# EAGLE design magic-donut (EAGLE 9.4.2)
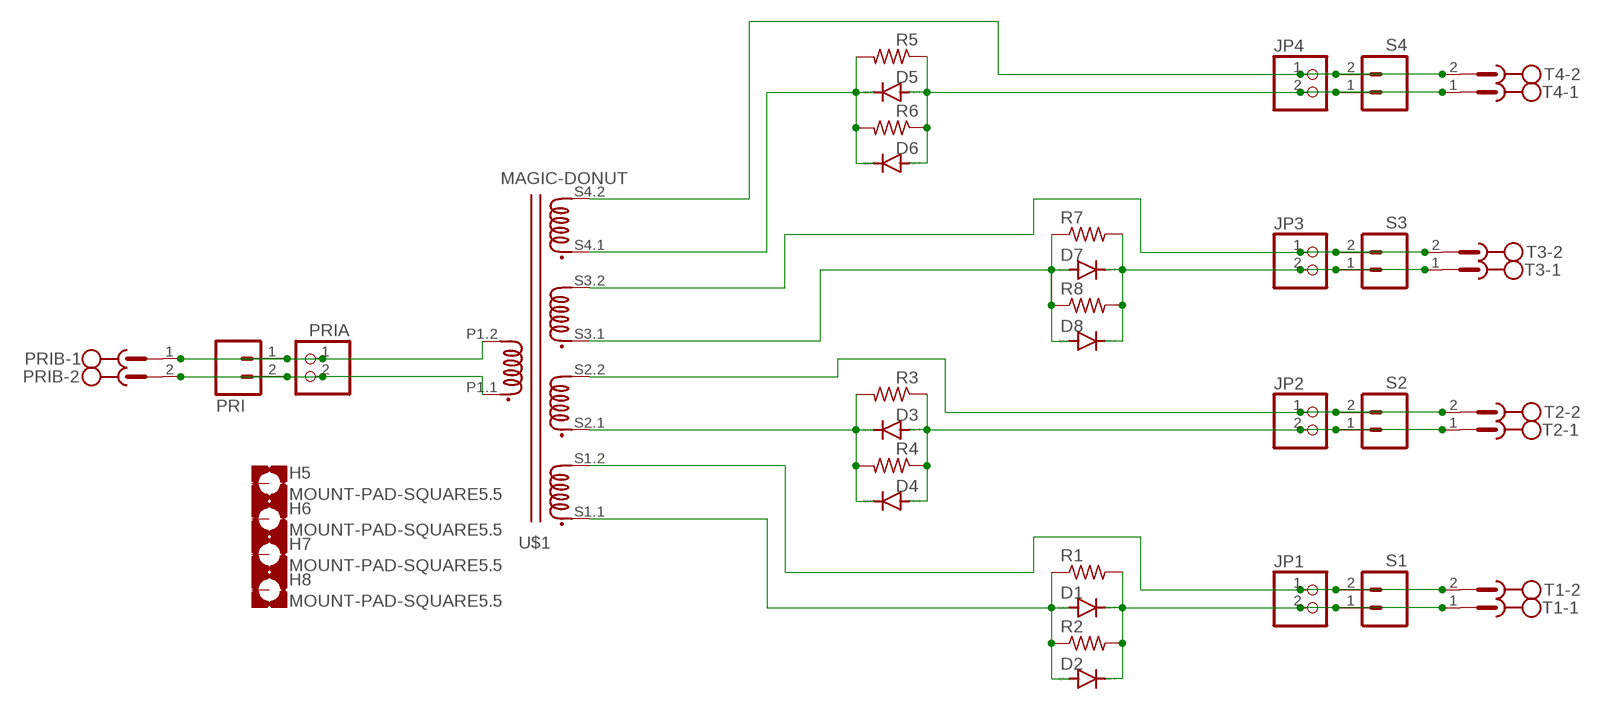
[diagram p0: schematic, sheet 1]

## Parts
D1  DIODE-DO214AA  [DO214AA]
D2  DIODE-DO201-15  [DO201-15]
D3  DIODE-DO214AA  [DO214AA]
D4  DIODE-DO201-15  [DO201-15]
D5  DIODE-DO214AA  [DO214AA]
D6  DIODE-DO201-15  [DO201-15]
D7  DIODE-DO214AA  [DO214AA]
D8  DIODE-DO201-15  [DO201-15]
H5  MOUNT-PAD-SQUARE5.5  [5,5-PAD-SQUARE]
H6  MOUNT-PAD-SQUARE5.5  [5,5-PAD-SQUARE]
H7  MOUNT-PAD-SQUARE5.5  [5,5-PAD-SQUARE]
H8  MOUNT-PAD-SQUARE5.5  [5,5-PAD-SQUARE]
JP1  PINHD-1X2  [1X02]
JP2  PINHD-1X2  [1X02]
JP3  PINHD-1X2  [1X02]
JP4  PINHD-1X2  [1X02]
PRI  M02JST-PTH-2  [JST-2-PTH]
PRIA  PINHD-1X2  [1X02]
PRIB  MSTBV2  [MSTBV2]
R1  R-US_R0805  [R0805]
R2  R-US_0207/7  [0207/7]
R3  R-US_R0805  [R0805]
R4  R-US_0207/7  [0207/7]
R5  R-US_R0805  [R0805]
R6  R-US_0207/7  [0207/7]
R7  R-US_R0805  [R0805]
R8  R-US_0207/7  [0207/7]
S1  M02JST-PTH-2  [JST-2-PTH]
S2  M02JST-PTH-2  [JST-2-PTH]
S3  M02JST-PTH-2  [JST-2-PTH]
S4  M02JST-PTH-2  [JST-2-PTH]
T1  MSTBV2  [MSTBV2]
T2  MSTBV2  [MSTBV2]
T3  MSTBV2  [MSTBV2]
T4  MSTBV2  [MSTBV2]
U$1  MAGIC-DONUT  [TOROID]

## Nets
N$4: D5.C D6.C R5.2 R6.2 U$1.S4.1
N$5: JP3.1 S3.2 T3.2 U$1.S3.2
N$6: D7.A D8.A R7.1 R8.1 U$1.S3.1
N$8: D3.A D4.A JP2.2 R3.1 R4.1 S2.1 T2.1
N$9: JP4.1 S4.2 T4.2 U$1.S4.2
N$11: PRI.1 PRIA.1 PRIB.1 U$1.P1.2
N$12: PRI.2 PRIA.2 PRIB.2 U$1.P1.1
N$17: D5.A D6.A JP4.2 R5.1 R6.1 S4.1 T4.1
N$20: D7.C D8.C JP3.2 R7.2 R8.2 S3.1 T3.1
N$21: JP2.1 S2.2 T2.2 U$1.S2.2
N$22: D3.C D4.C R3.2 R4.2 U$1.S2.1
N$23: JP1.1 S1.2 T1.2 U$1.S1.2
N$26: D1.C D2.C JP1.2 R1.2 R2.2 S1.1 T1.1
S1-1: D1.A D2.A R1.1 R2.1 U$1.S1.1
Unconnected: H5.B5,5(MOUNT) H6.B5,5(MOUNT) H7.B5,5(MOUNT) H8.B5,5(MOUNT)

## Library data of the parts
D1-D8 = diode:DIODE-: DIODE
H5-H8 = holes:MOUNT-PAD-SQUARE: MOUNTING PAD, square
JP1-JP4 PRIA = pinhead:PINHD-1X2: PIN HEADER
PRI S1-S4 = SparkFun-Connectors:M02: Standard 2-pin 0.1" header. Use with - straight break away headers ( PRT-00116) - right angle break away headers (PRT-00553) - swiss pins (PRT-00743) - machine pins (PRT-00117) - female headers (PRT-00115) Molex polarized connector foot print use with: PRT-08233 with associated crimp pins and housings. 2.54_SCREWTERM for use with PRT-10571. 3.5mm Screw Terminal footprints for PRT-08084 5mm Screw Terminal footprints for use with PRT-08432; PROD_ID: CONN-09863; SKU: PRT-09914
PRIB T1-T4 = con-phoenix-500:MSTBV2: PHOENIX; OC_FARNELL: unknown; OC_NEWARK: unknown
R1-R8 = rcl:R-US_: RESISTOR, American symbol; SPICEPREFIX: R
U$1 = magic-donut:MAGIC-DONUT

## Net classes
0 default: width 1.016 mm

## Board
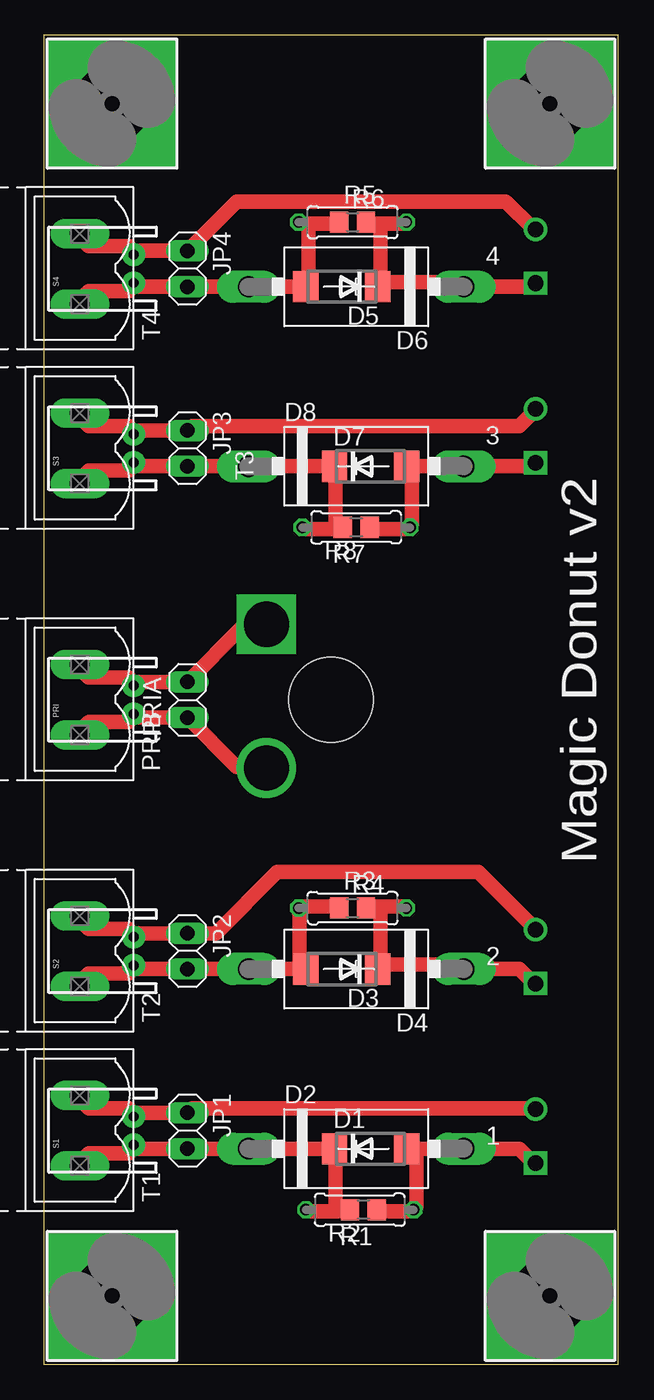
[diagram p1: board, top side]
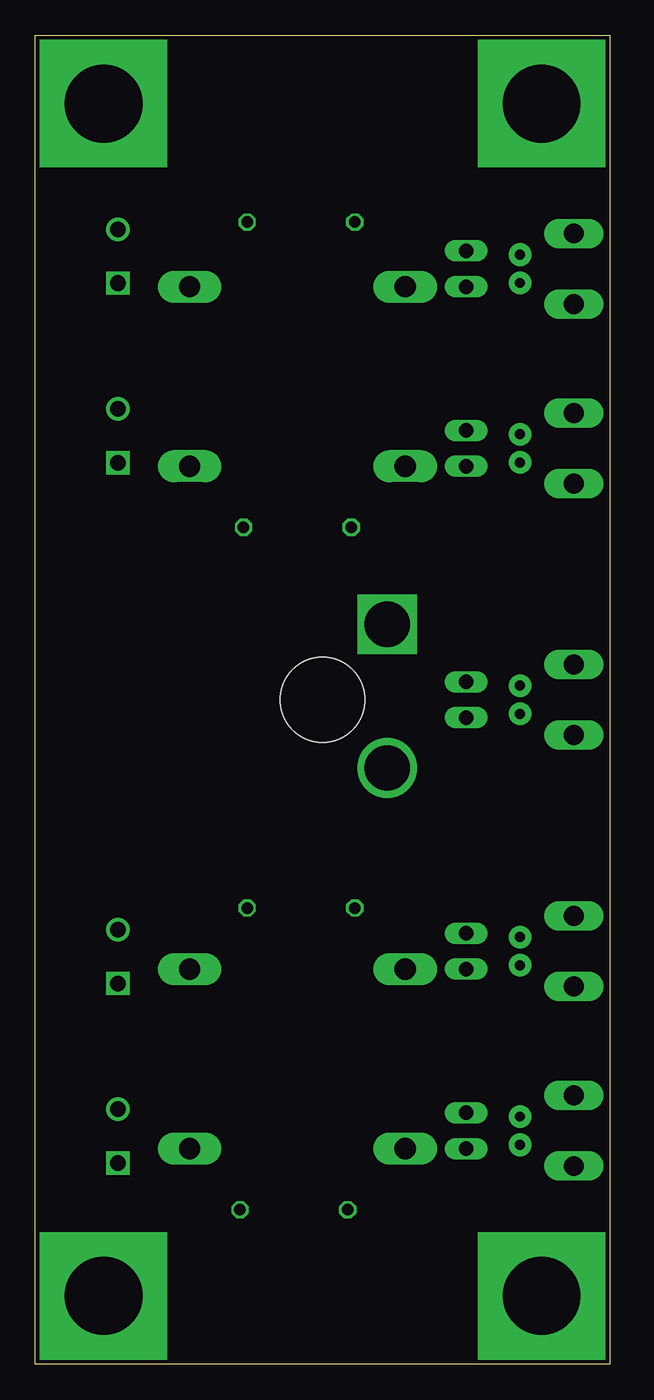
[diagram p2: board, bottom side, seen from below]

Size 40.64 x 93.98 mm. Coordinates in mm from the lower left corner, seen from the top.
Outline: 0,0 40.64,0 40.64,93.98 0,93.98 0,0
Copper layers (1*16): Top 0.0356mm / dielectric 1.5011mm / Bottom 0.0356mm
Design rules "oshpark": minimum track width 6mil, minimum drill 13mil, track to track 6mil, track to pad 6mil, pad to pad 6mil, via to via 6mil, smd to smd 6mil, copper to edge 15mil, drill to drill 6mil, minimum pad ring 7mil, minimum via ring 7mil, stop-mask expansion 3mil, vias tented up to drill 0mil, thermal gap 10mil
Holes 5.99 mm at 20.32,46.99

### Footprints (pad centres in the part's own frame; a part is rotated, then mirrored left to right if it is on the bottom)
DO214AA = smd 1.8 x 2.2: A 2.55,0; C -2.55,0
DO201-15 = drill 1.499 long: A 7.62,0; C -7.62,0
5,5-PAD-SQUARE = drill 5.5 pad 9 square: B5,5 0,0
1X02 = drill 1.016 long: 1 -1.27,0; 2 1.27,0
JST-2-PTH = drill 0.7 pad 1.6: 1 -1,0; 2 1,0
MSTBV2 = drill 1.397 long: 1 -2.5,0; 2 2.5,0
R0805 = smd 1.3 x 1.5: 1 -0.95,0; 2 0.95,0
0207/7 = drill 0.813 octagon: 1 -3.81,0; 2 3.81,0
TOROID = drill 3.2 square: P1.1 19.05,-5.08 | drill 3.2: P1.2 19.05,5.08 | drill 1.1 square: S1.1 0,33.02; S2.1 0,20.32; S3.1 0,-16.51; S4.1 0,-29.21 | drill 1.1: S1.2 0,29.21; S2.2 0,16.51; S3.2 0,-20.32; S4.2 0,-33.02

### Placement (x,y rotation side)
D1  23.11,15.24 0 top
D2  22.1,15.24 0 top
D3  21.08,27.94 180 top
D4  22.1,27.94 180 top
D5  21.08,76.2 180 top
D6  22.1,76.2 180 top
D7  23.11,63.5 0 top
D8  22.1,63.5 0 top
H5  4.83,4.83 0 top
H6  4.83,89.15 0 top
H7  35.81,4.83 0 top
H8  35.81,89.15 0 top
JP1  10.16,16.51 270 top
JP2  10.16,29.21 270 top
JP3  10.16,64.77 270 top
JP4  10.16,77.47 270 top
PRI  6.35,46.99 90 top
PRIA  10.16,46.99 90 top
PRIB  2.54,46.99 90 top
R1  22.61,10.92 180 top
R2  22.35,10.92 180 top
R3  21.84,32.26 0 top
R4  21.84,32.26 0 top
R5  21.84,80.77 0 top
R6  21.84,80.77 0 top
R7  22.1,59.18 180 top
R8  22.1,59.18 180 top
S1  6.35,16.51 90 top
S2  6.35,29.21 90 top
S3  6.35,64.77 90 top
S4  6.35,77.47 90 top
T1  2.54,16.51 90 top
T2  2.54,29.21 90 top
T3  2.54,64.77 90 top
T4  2.54,77.47 90 top
U$1  34.8,47.24 180 top

### Tracks (layer width: path | path; a pad name or v marks a point on that pad's centre or on a via)
N$4
  Top 1.016: 23.81,80.64 25.4,80.64 R6.2 | 23.81,80.64 22.86,80.64 R5.2 | 23.81,80.64 23.81,76.2 D5.C 24.13,76.52 29.53,76.52 D6.C 34.61,76.2 U$1.S4.1
N$5
  Top 1.016: U$1.S3.2 34.61,67.31 33.66,66.36 10.48,66.36 JP3.1 6.35,66.04 S3.2 6.03,66.36 3.17,66.36 2.54,66.99 T3.2
N$6
  Top 1.016: R7.1 23.18,59.05 25.72,59.05 R8.1 26.04,59.37 26.04,63.18 D7.A D8.A 34.61,63.5 U$1.S3.1
N$8
  Top 1.016: T2.1 2.54,26.99 3.17,27.62 6.03,27.62 S2.1 6.35,27.94 JP2.2 D4.A D3.A 18.1,28.26 18.1,31.75 R4.1 18.1,32.38 20.64,32.38 R3.1
N$9
  Top 1.016: U$1.S4.2 34.61,80.33 32.7,82.23 13.65,82.23 JP4.1 6.35,78.74 S4.2 6.03,79.06 3.17,79.06 2.54,79.69 T4.2
N$11
  Top 1.016: PRIB.1 2.54,44.77 3.17,45.4 6.03,45.4 PRI.1 6.35,45.72 PRIA.1 13.65,42.23 15.56,42.23 U$1.P1.2
N$12
  Top 1.016: PRIB.2 2.54,49.21 3.17,48.58 6.03,48.58 PRI.2 6.35,48.26 PRIA.2 13.97,52.07 15.56,52.07 U$1.P1.1
N$17
  Top 1.016: T4.1 2.54,75.25 3.17,75.88 6.03,75.88 S4.1 6.35,76.2 JP4.2 D6.A D5.A 18.73,76.52 18.73,80.64 | 18.73,80.64 18.1,80.64 R6.1 | 18.73,80.64 20.64,80.64 R5.1
N$20
  Top 1.016: R8.2 18.41,59.05 20.95,59.05 R7.2 20.64,59.37 20.64,63.5 D7.C D8.C JP3.2 6.35,63.5 S3.1 6.03,63.18 3.17,63.18 2.54,62.55 T3.1
N$21
  Top 1.016: T2.2 2.54,31.43 3.17,30.8 6.03,30.8 S2.2 6.35,30.48 JP2.1 12.19,30.48 16.51,34.8 30.73,34.8 U$1.S2.2
  Bottom 1.016: 34.61,30.48 U$1.S2.2
N$22
  Top 1.016: 23.81,32.38 25.4,32.38 R4.2 | 23.81,32.38 22.86,32.38 R3.2 | 23.81,32.38 23.81,27.94 D3.C 24.13,28.26 29.53,28.26 D4.C 33.66,27.94 34.61,26.99 U$1.S2.1
N$23
  Top 1.016: U$1.S1.2 34.61,18.1 10.48,18.1 JP1.1 6.35,17.78 S1.2 6.03,18.1 3.17,18.1 2.54,18.73 T1.2
N$26
  Top 1.016: 20.64,10.79 18.73,10.79 R2.2 | 20.64,10.79 21.59,10.79 R1.2 | 20.64,10.79 20.64,15.24 D1.C D2.C JP1.2 6.35,15.24 S1.1 6.03,14.92 3.17,14.92 2.54,14.29 T1.1
S1-1
  Top 1.016: R1.1 23.81,10.79 26.04,10.79 R2.1 26.35,11.11 26.35,14.92 D1.A D2.A 33.66,15.24 34.61,14.29 U$1.S1.1

### Text on the board
tPlace: Magic Donut v2